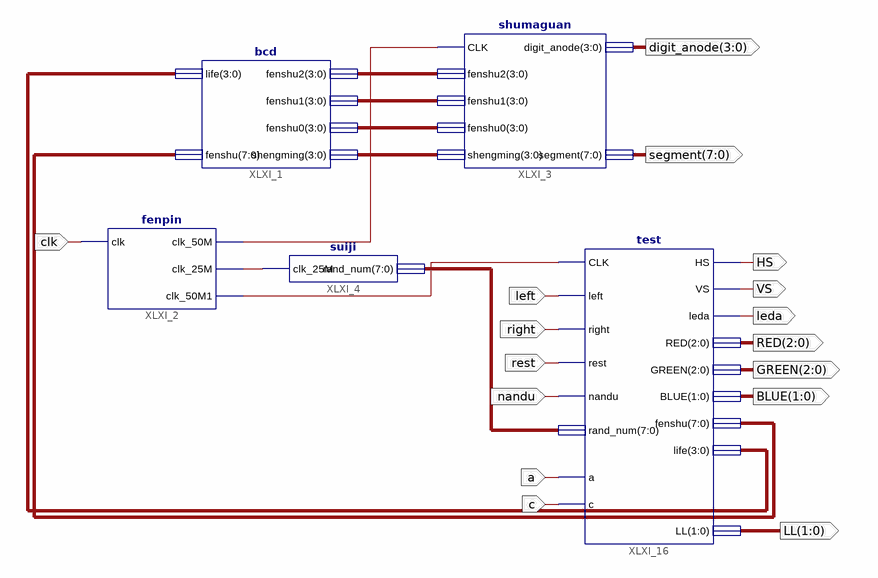
[diagram p0: schematic sheet 1]
// Xilinx ISE schematic yyy.sch (spartan3e) as structural Verilog: 5 symbols, 16 ports
module yyy (
  input  clk,
  input  left,
  input  right,
  input  rest,
  input  nandu,
  input  a,
  input  c,
  output HS,
  output VS,
  output leda,
  output [2:0] RED,
  output [2:0] GREEN,
  output [1:0] BLUE,
  output [3:0] digit_anode,
  output [7:0] segment,
  output [1:0] LL
);

  wire XLXN_1, XLXN_2, XLXN_3;
  wire [3:0] XLXN_5, XLXN_6, XLXN_7, XLXN_8, XLXN_23;
  wire [7:0] XLXN_4, XLXN_22;

  bcd XLXI_1 (
    .life(XLXN_23), .fenshu(XLXN_22), .fenshu2(XLXN_5), .fenshu1(XLXN_6), .fenshu0(XLXN_7), .shengming(XLXN_8));
  fenpin XLXI_2 (.clk(clk), .clk_50M(XLXN_2), .clk_25M(XLXN_1), .clk_50M1(XLXN_3));
  shumaguan XLXI_3 (
    .CLK(XLXN_2), .fenshu2(XLXN_5), .fenshu1(XLXN_6), .fenshu0(XLXN_7), .shengming(XLXN_8),
    .digit_anode(digit_anode), .segment(segment));
  suiji XLXI_4 (.clk_25M(XLXN_1), .rand_num(XLXN_4));
  test XLXI_16 (
    .CLK(XLXN_3), .left(left), .right(right), .rest(rest), .a(a), .c(c), .nandu(nandu), .rand_num(XLXN_4),
    .HS(HS), .VS(VS), .leda(leda), .RED(RED), .GREEN(GREEN), .BLUE(BLUE), .fenshu(XLXN_22), .life(XLXN_23),
    .LL(LL));
endmodule
